# EAGLE design 4051-analogswitch (EAGLE 9.2.0)
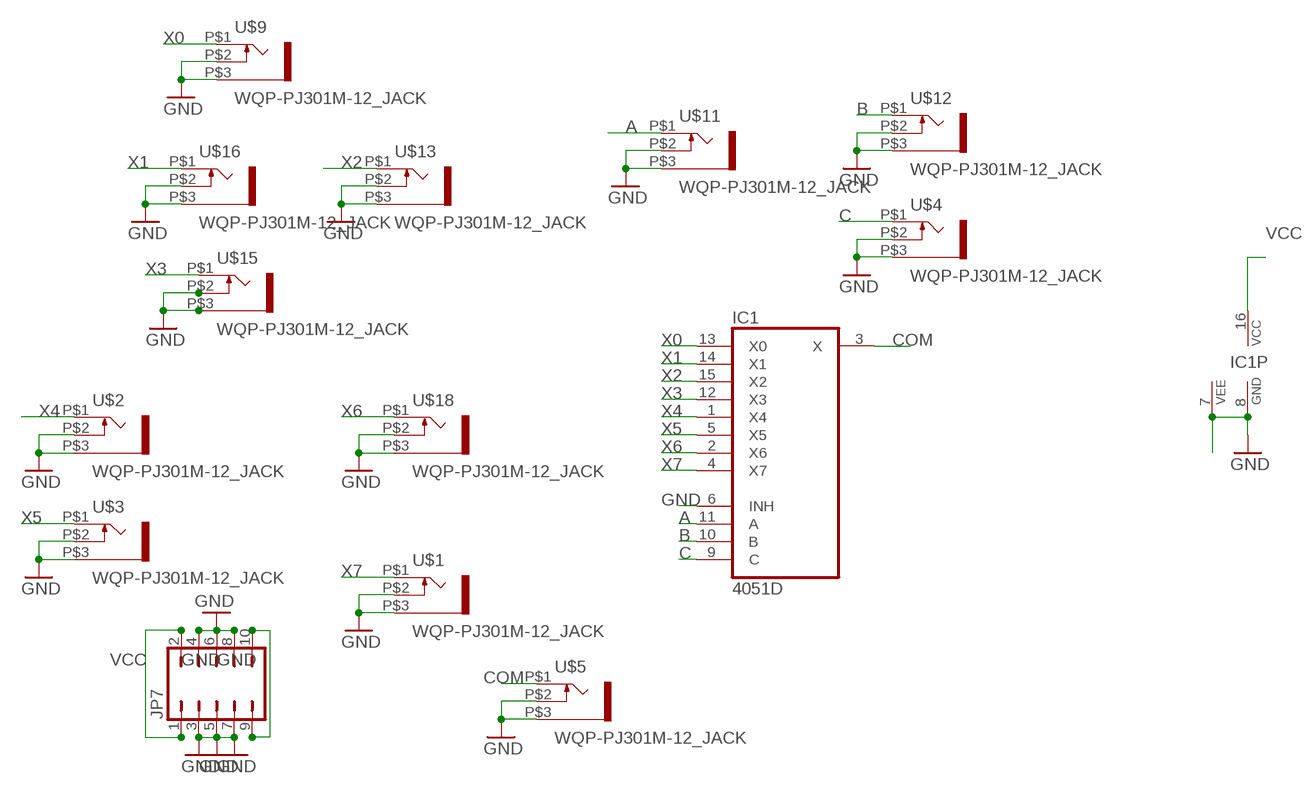
[diagram p0: schematic, sheet 1]

## Parts
IC1  4051D  [SO16]
JP7  JP5Q  [JP5Q]
U$1  WQP-PJ301M-12_JACK  [WQP-PJ301M-12_JACK]
U$2  WQP-PJ301M-12_JACK  [WQP-PJ301M-12_JACK]
U$3  WQP-PJ301M-12_JACK  [WQP-PJ301M-12_JACK]
U$4  WQP-PJ301M-12_JACK  [WQP-PJ301M-12_JACK]
U$5  WQP-PJ301M-12_JACK  [WQP-PJ301M-12_JACK]
U$9  WQP-PJ301M-12_JACK  [WQP-PJ301M-12_JACK]
U$11  WQP-PJ301M-12_JACK  [WQP-PJ301M-12_JACK]
U$12  WQP-PJ301M-12_JACK  [WQP-PJ301M-12_JACK]
U$13  WQP-PJ301M-12_JACK  [WQP-PJ301M-12_JACK]
U$15  WQP-PJ301M-12_JACK  [WQP-PJ301M-12_JACK]
U$16  WQP-PJ301M-12_JACK  [WQP-PJ301M-12_JACK]
U$18  WQP-PJ301M-12_JACK  [WQP-PJ301M-12_JACK]

## Nets
A: IC1.11(A) U$11.P$1
B: IC1.10(B) U$12.P$1
C: IC1.9(C) U$4.P$1
COM: IC1.3(X) U$5.P$1
GND: IC1.6(INH) IC1.7(VEE) IC1.8(GND) JP7.3 JP7.4 JP7.5 JP7.6 JP7.7 JP7.8 U$1.P$2 U$1.P$3 U$2.P$2 U$2.P$3 U$3.P$2 U$3.P$3 U$4.P$2 U$4.P$3 U$5.P$2 U$5.P$3 U$9.P$2 U$9.P$3 U$11.P$2 U$11.P$3 U$12.P$2 U$12.P$3 U$13.P$2 U$13.P$3 U$15.P$2 U$15.P$3 U$16.P$2 U$16.P$3 U$18.P$2 U$18.P$3
N$6: JP7.9 JP7.10
VCC: IC1.16(VCC) JP7.1 JP7.2
X0: IC1.13(X0) U$9.P$1
X1: IC1.14(X1) U$16.P$1
X2: IC1.15(X2) U$13.P$1
X3: IC1.12(X3) U$15.P$1
X4: IC1.1(X4) U$2.P$1
X5: IC1.5(X5) U$3.P$1
X6: IC1.2(X6) U$18.P$1
X7: IC1.4(X7) U$1.P$1

## Library data of the parts
IC1 = 40xx:4051: 8-channel ANALOG MULTIPLEXER
JP7 = jumper:JP5Q: JUMPER
U$1-U$5 U$9 U$11-U$13 U$15 U$16 U$18 = thonkiconn:WQP-PJ301M-12_JACK

## Board
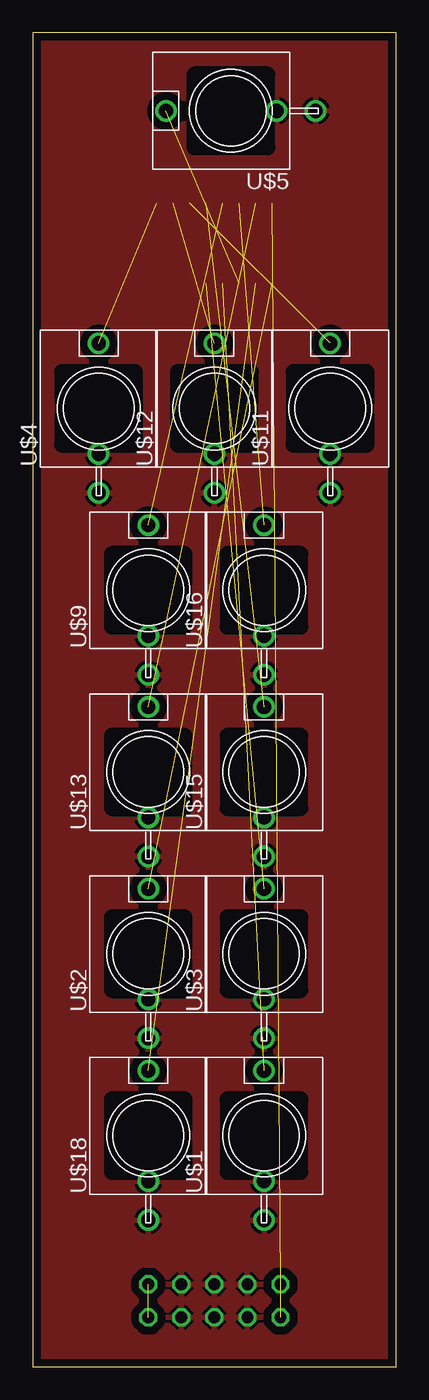
[diagram p1: board, top side]
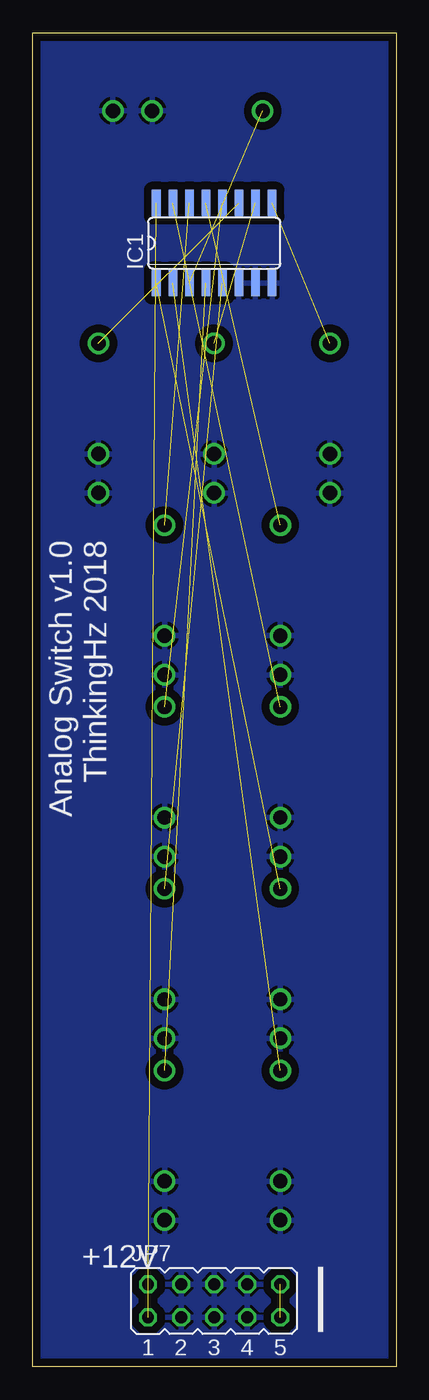
[diagram p2: board, bottom side, seen from below]

Size 27.92 x 102.54 mm. Coordinates in mm from the lower left corner, seen from the top.
Outline: 0,0 27.92,0 27.92,102.54 0,102.54 0,0
Copper layers (1*16): Top 0.035559375mm / dielectric 1.6mm / Bottom 0.035559375mm
Design rules "oshpark-2layer": minimum track width 6mil, minimum drill 10mil, track to track 6mil, track to pad 6mil, pad to pad 6mil, via to via 6mil, smd to smd 6mil, copper to edge 15mil, drill to drill 6mil, minimum pad ring 5mil, minimum via ring 5mil, stop-mask expansion 2.5mil, vias tented up to drill 0mil, thermal gap 10mil

### Footprints (pad centres in the part's own frame; a part is rotated, then mirrored left to right if it is on the bottom)
SO16 = smd 0.66 x 2.032: 1 -4.445,-3.073; 2 -3.175,-3.073; 3 -1.905,-3.073; 4 -0.635,-3.073; 5 0.635,-3.073; 6 1.905,-3.073; 7 3.175,-3.073; 8 4.445,-3.073; 9 4.445,3.073; 10 3.175,3.073; 11 1.905,3.073; 12 0.635,3.073; 13 -0.635,3.073; 14 -1.905,3.073; 15 -3.175,3.073; 16 -4.445,3.073
JP5Q = drill 0.914 octagon: 1 -5.08,-1.27; 2 -5.08,1.27; 3 -2.54,-1.27; 4 -2.54,1.27; 5 0,-1.27; 6 0,1.27; 7 2.54,-1.27; 8 2.54,1.27; 9 5.08,-1.27; 10 5.08,1.27
WQP-PJ301M-12_JACK = drill 1.1: P$1 0,5; P$2 0,-3.5; P$3 0,-6.5

### Placement (x,y rotation side)
IC1  13.97,86.36 0 bottom
JP7  13.97,5.08 0 bottom
U$1  17.78,17.78 0 top
U$2  8.89,31.75 0 top
U$3  17.78,31.75 0 top
U$4  5.08,73.66 0 top
U$5  15.24,96.52 90 top
U$9  8.89,59.69 0 top
U$11  22.86,73.66 0 top
U$12  13.97,73.66 0 top
U$13  8.89,45.72 0 top
U$15  17.78,45.72 0 top
U$16  17.78,59.69 0 top
U$18  8.89,17.78 0 top

### Tracks (layer width: path | path; a pad name or v marks a point on that pad's centre or on a via)
A  (1 unrouted)
B  (1 unrouted)
C  (1 unrouted)
COM  (1 unrouted)
GND
  pour Top (isolate 0.61): 0,102.87 27.94,102.87 27.94,0 0,0
  pour Bottom (isolate 0.61): 0,102.87 27.94,102.87 27.94,0 0,0
N$6  (1 unrouted)
VCC  (2 unrouted)
X0  (1 unrouted)
X1  (1 unrouted)
X2  (1 unrouted)
X3  (1 unrouted)
X4  (1 unrouted)
X5  (1 unrouted)
X6  (1 unrouted)
X7  (1 unrouted)

### Text on the board
bNames: Analog Switch v1.0 / ThinkingHz 2018 | | | +12V